# EAGLE schematic xmos_avb_brd_V4 (EAGLE 9.6.2)

## Sheet 1 of 4: XMOS
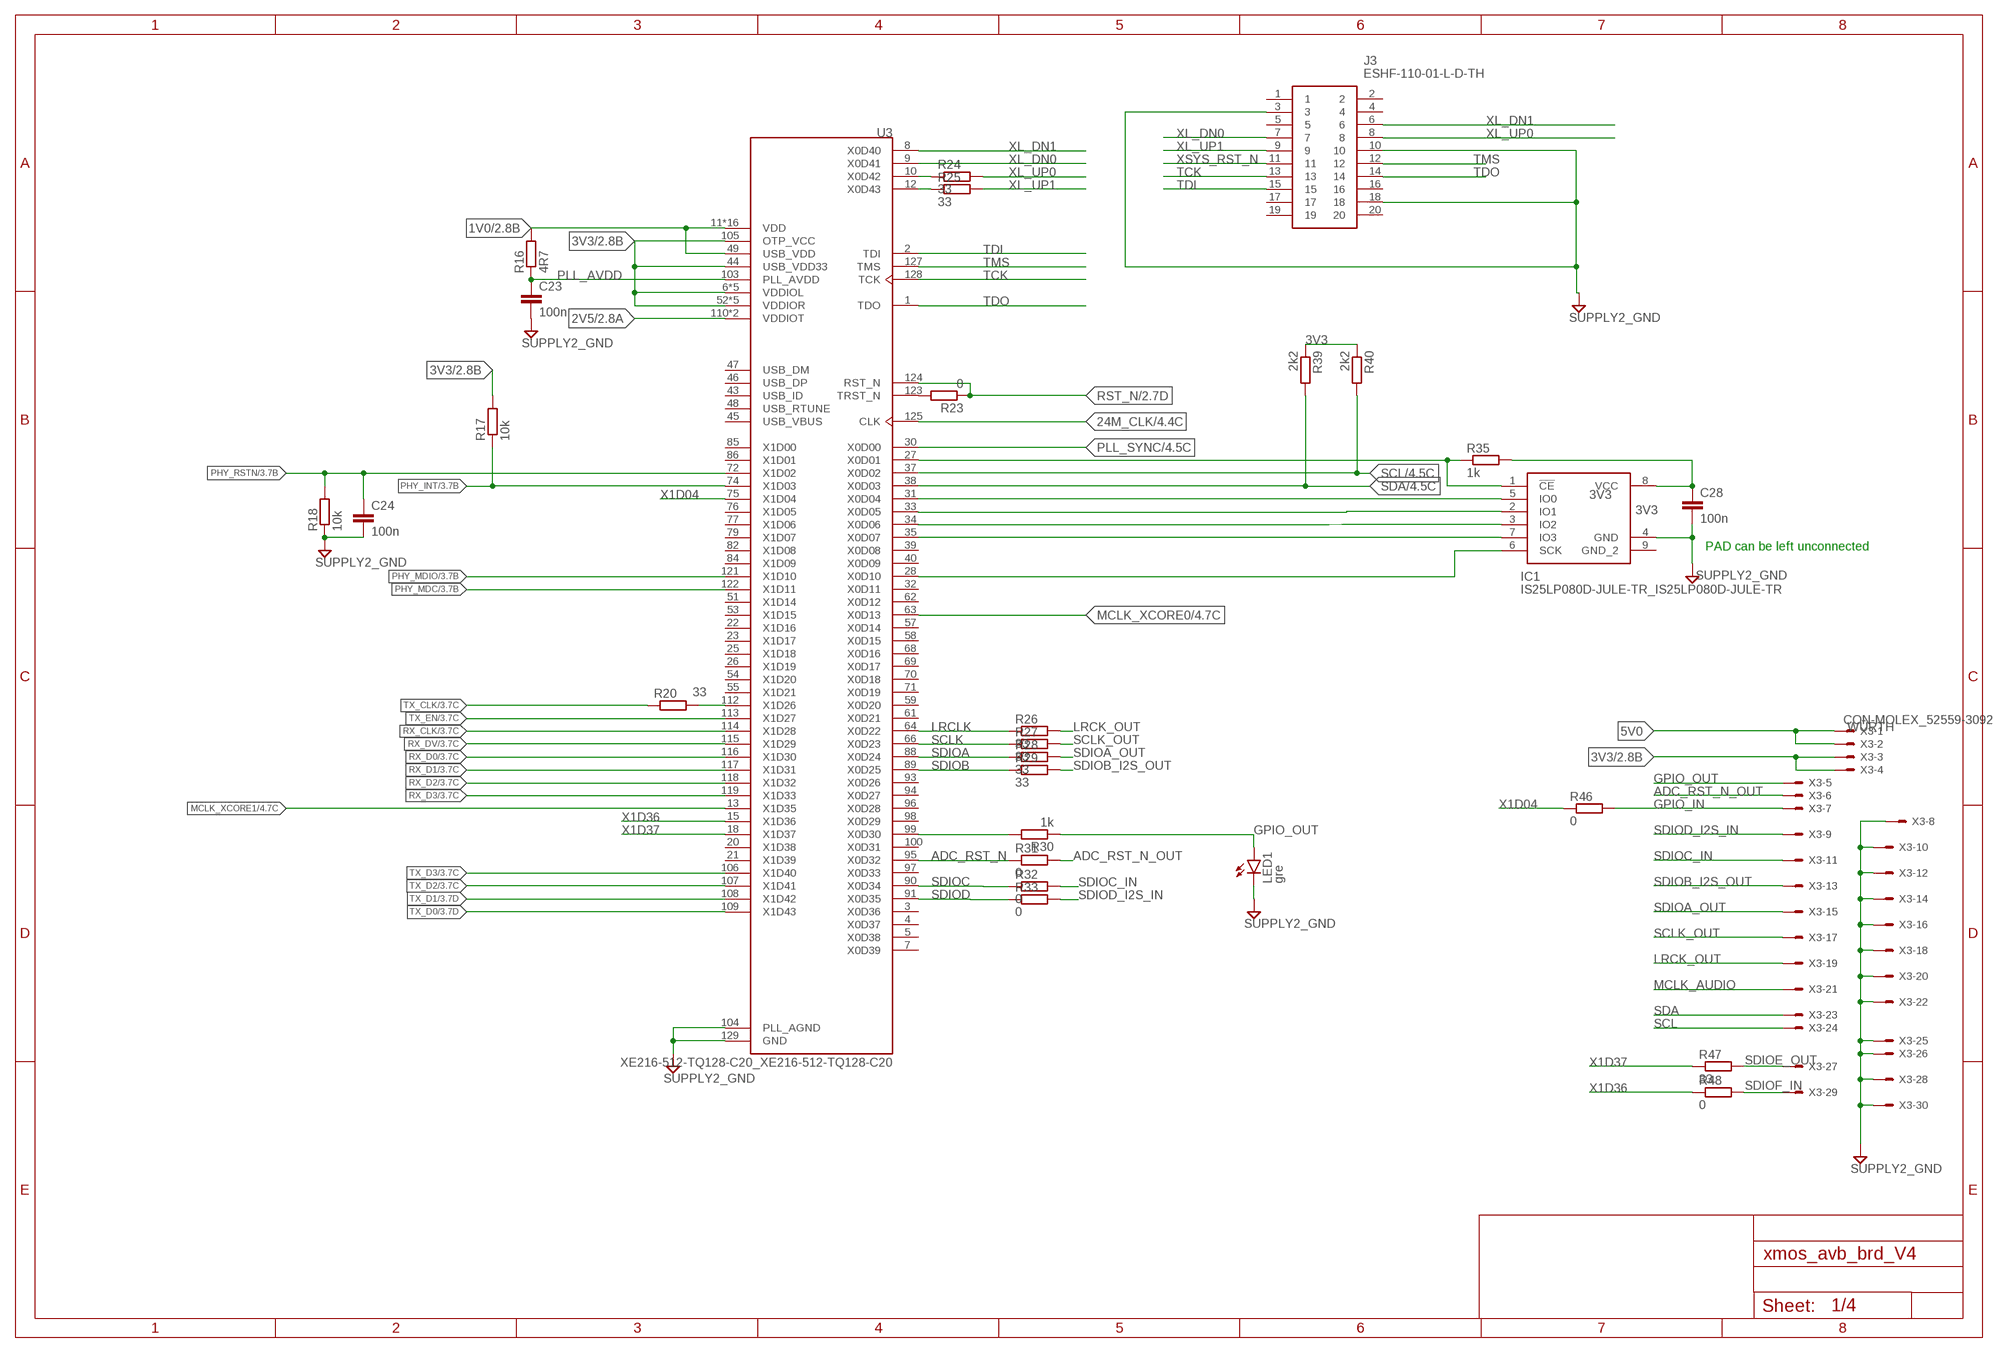
[diagram p0: schematic, sheet 1]

### Parts
C23  100n  RCL_C-EUC0402  [RCL_C0402]
C24  100n  RCL_C-EUC0402  [RCL_C0402]
C28  100n  RCL_C-EUC0402  [RCL_C0402]
IC1  IS25LP080D-JULE-TR_IS25LP080D-JULE-TR  [IS25LP080D-JULE-TR_SON50P300X200X55-9N]
J3  ESHF-110-01-L-D-TH  [SHDR20W41P127_2X10_1905X559X54]
LED1  gre  LED_LEDCHIP-LED0603  [LED_CHIP-LED0603]
R16  4R7  RCL_R-EU_R0402  [RCL_R0402]
R17  10k  RCL_R-EU_R0402  [RCL_R0402]
R18  10k  RCL_R-EU_R0402  [RCL_R0402]
R20  33  RCL_R-EU_R0402  [RCL_R0402]
R23  0  RCL_R-EU_R0402  [RCL_R0402]
R24  33  RCL_R-EU_R0402  [RCL_R0402]
R25  33  RCL_R-EU_R0402  [RCL_R0402]
R26  33  RCL_R-EU_R0402  [RCL_R0402]
R27  33  RCL_R-EU_R0402  [RCL_R0402]
R28  33  RCL_R-EU_R0402  [RCL_R0402]
R29  33  RCL_R-EU_R0402  [RCL_R0402]
R30  1k  RCL_R-EU_R0402  [RCL_R0402]
R31  0  RCL_R-EU_R0402  [RCL_R0402]
R32  0  RCL_R-EU_R0402  [RCL_R0402]
R33  0  RCL_R-EU_R0402  [RCL_R0402]
R35  1k  RCL_R-EU_R0402  [RCL_R0402]
R39  2k2  RCL_R-EU_R0402  [RCL_R0402]
R40  2k2  RCL_R-EU_R0402  [RCL_R0402]
R46  0  RCL_R-EU_R0402  [RCL_R0402]
R47  33  RCL_R-EU_R0402  [RCL_R0402]
R48  0  RCL_R-EU_R0402  [RCL_R0402]
U3  XE216-512-TQ128-C20_XE216-512-TQ128-C20  [XE216-512-TQ128-C20_QFP40P1600X1600X120-129N]
X3  CON-MOLEX_52559-3092  [CON-MOLEX_52559-3092]

### Nets
1V0 [PWR]: R16.2 U3.11(VDD) U3.16(VDD) U3.17(VDD) U3.24(VDD) U3.36(VDD) U3.41(VDD) U3.49(USB_VDD) U3.56(VDD) U3.60(VDD) U3.73(VDD) U3.80(VDD) U3.81(VDD) U3.87(VDD) U3.101(VDD) U3.102(VDD) U3.120(VDD) U3.126(VDD) ; also sheet 2
2V5 [PWR]: U3.110(VDDIOT) U3.111(VDDIOT) ; also sheet 2
3V3 [PWR]: C28.1 IC1.8(VCC) R17.2 R35.2 R39.1 R40.1 U3.6(VDDIOL) U3.14(VDDIOL) U3.19(VDDIOL) U3.29(VDDIOL) U3.42(VDDIOL) U3.44(USB_VDD33) U3.52(VDDIOR) U3.67(VDDIOR) U3.78(VDDIOR) U3.83(VDDIOR) U3.92(VDDIOR) U3.105(OTP_VCC) X3.3 X3.4 ; also sheet 2,3,4
5V0 [PWR]: X3.1 X3.2 ; also sheet 2
24M_CLK [diff pairs]: U3.125(CLK) ; also sheet 4
ADC_RST_N [diff pairs]: R31.1 U3.95(X0D32)
ADC_RST_N_OUT: R31.2 X3.6
GND [GND]: C23.2 C24.2 C28.2 IC1.4(GND) J3.3 J3.10 J3.18 LED1.C R18.1 U3.104(PLL_AGND) U3.129(GND) X3.8 X3.10 X3.12 X3.14 X3.16 X3.18 X3.20 X3.22 X3.25 X3.26 X3.28 X3.30 ; supply symbol labelled SUPPLY2_GND ; also sheet 2,3,4
GPIO_IN: R46.2 X3.7
GPIO_OUT: LED1.A R30.1 X3.5
LRCK_OUT: R26.2 X3.19
LRCLK: R26.1 U3.64(X0D22)
MCLK_AUDIO [diff pairs]: X3.21 ; also sheet 4
MCLK_XCORE0 [diff pairs]: U3.63(X0D13) ; also sheet 4
MCLK_XCORE1 [diff pairs]: U3.13(X1D35) ; also sheet 4
N$5 [diff pairs]: R30.2 U3.99(X0D30)
N$24: IC1.6(SCK) U3.28(X0D10)
N$26: IC1.5(IO0) U3.31(X0D04)
N$28: IC1.2(IO1) U3.33(X0D05)
N$30: IC1.3(IO2) U3.34(X0D06)
N$35: R20.2 U3.112(X1D26)
N$42: IC1.7(IO3) U3.35(X0D07)
N$43: R24.1 U3.10(X0D42)
N$44: R25.1 U3.12(X0D43)
N$77: R23.2 U3.123(TRST_N)
PHY_INT: R17.1 U3.74(X1D03) ; also sheet 3
PHY_MDC: U3.122(X1D11) ; also sheet 3
PHY_MDIO: U3.121(X1D10) ; also sheet 3
PHY_RSTN: C24.1 R18.2 U3.72(X1D02) ; also sheet 3
PLL_AVDD [diff pairs]: C23.1 R16.1 U3.103(PLL_AVDD)
PLL_SYNC: U3.30(X0D00) ; also sheet 4
RST_N: R23.1 U3.124(RST_N) ; also sheet 2
RX_CLK: U3.114(X1D28) ; also sheet 3
RX_D0: U3.116(X1D30) ; also sheet 3
RX_D1: U3.117(X1D31) ; also sheet 3
RX_D2: U3.118(X1D32) ; also sheet 3
RX_D3: U3.119(X1D33) ; also sheet 3
RX_DV: U3.115(X1D29) ; also sheet 3
SCL: R40.2 U3.37(X0D02) X3.24 ; also sheet 4
SCLK [diff pairs]: R27.1 U3.66(X0D23)
SCLK_OUT: R27.2 X3.17
SDA: R39.2 U3.38(X0D03) X3.23 ; also sheet 4
SDIOA [diff pairs]: R28.1 U3.88(X0D24)
SDIOA_OUT: R28.2 X3.15
SDIOB [diff pairs]: R29.1 U3.89(X0D25)
SDIOB_I2S_OUT: R29.2 X3.13
SDIOC [diff pairs]: R32.1 U3.90(X0D34)
SDIOC_IN [diff pairs]: R32.2 X3.11
SDIOD [diff pairs]: R33.1 U3.91(X0D35)
SDIOD_I2S_IN [diff pairs]: R33.2 X3.9
SDIOE_OUT: R47.2 X3.27
SDIOF_IN [diff pairs]: R48.2 X3.29
SPI_CS [diff pairs]: IC1.1(!CE) R35.1 U3.27(X0D01)
TCK: J3.13 U3.128(TCK)
TDI: J3.15 U3.2(TDI)
TDO: J3.14 U3.1(TDO)
TMS: J3.12 U3.127(TMS)
TX_CLK: R20.1 ; also sheet 3
TX_D0: U3.109(X1D43) ; also sheet 3
TX_D1: U3.108(X1D42) ; also sheet 3
TX_D2: U3.107(X1D41) ; also sheet 3
TX_D3: U3.106(X1D40) ; also sheet 3
TX_EN: U3.113(X1D27) ; also sheet 3
X1D04: R46.1 U3.75(X1D04)
X1D36: R48.1 U3.15(X1D36)
X1D37: R47.1 U3.18(X1D37)
XL_DN0 [diff pairs]: J3.7 U3.9(X0D41)
XL_DN1 [diff pairs]: J3.6 U3.8(X0D40)
XL_UP0: J3.8 R24.2
XL_UP1: J3.9 R25.2
XSYS_RST_N: J3.11 ; also sheet 2
Unconnected: IC1.9(GND_2) J3.1 J3.2 J3.4 J3.5 J3.16 J3.17 J3.19 J3.20 U3.3(X0D36) U3.4(X0D37) U3.5(X0D38) U3.7(X0D39) U3.20(X1D38) U3.21(X1D39) U3.22(X1D16) U3.23(X1D17) U3.25(X1D18) U3.26(X1D19) U3.32(X0D11) U3.39(X0D08) U3.40(X0D09) U3.43(USB_ID) U3.45(USB_VBUS) U3.46(USB_DP) U3.47(USB_DM) U3.48(USB_RTUNE) U3.51(X1D14) U3.53(X1D15) U3.54(X1D20) U3.55(X1D21) U3.57(X0D14) U3.58(X0D15) U3.59(X0D20) U3.61(X0D21) U3.62(X0D12) U3.68(X0D16) U3.69(X0D17) U3.70(X0D18) U3.71(X0D19) U3.76(X1D05) U3.77(X1D06) U3.79(X1D07) U3.82(X1D08) U3.84(X1D09) U3.85(X1D00) U3.86(X1D01) U3.93(X0D26) U3.94(X0D27) U3.96(X0D28) U3.97(X0D33) U3.98(X0D29) U3.100(X0D31)

### Notes on the sheet
- PAD can be left unconnected

## Sheet 2 of 4: Power supplies & Reset
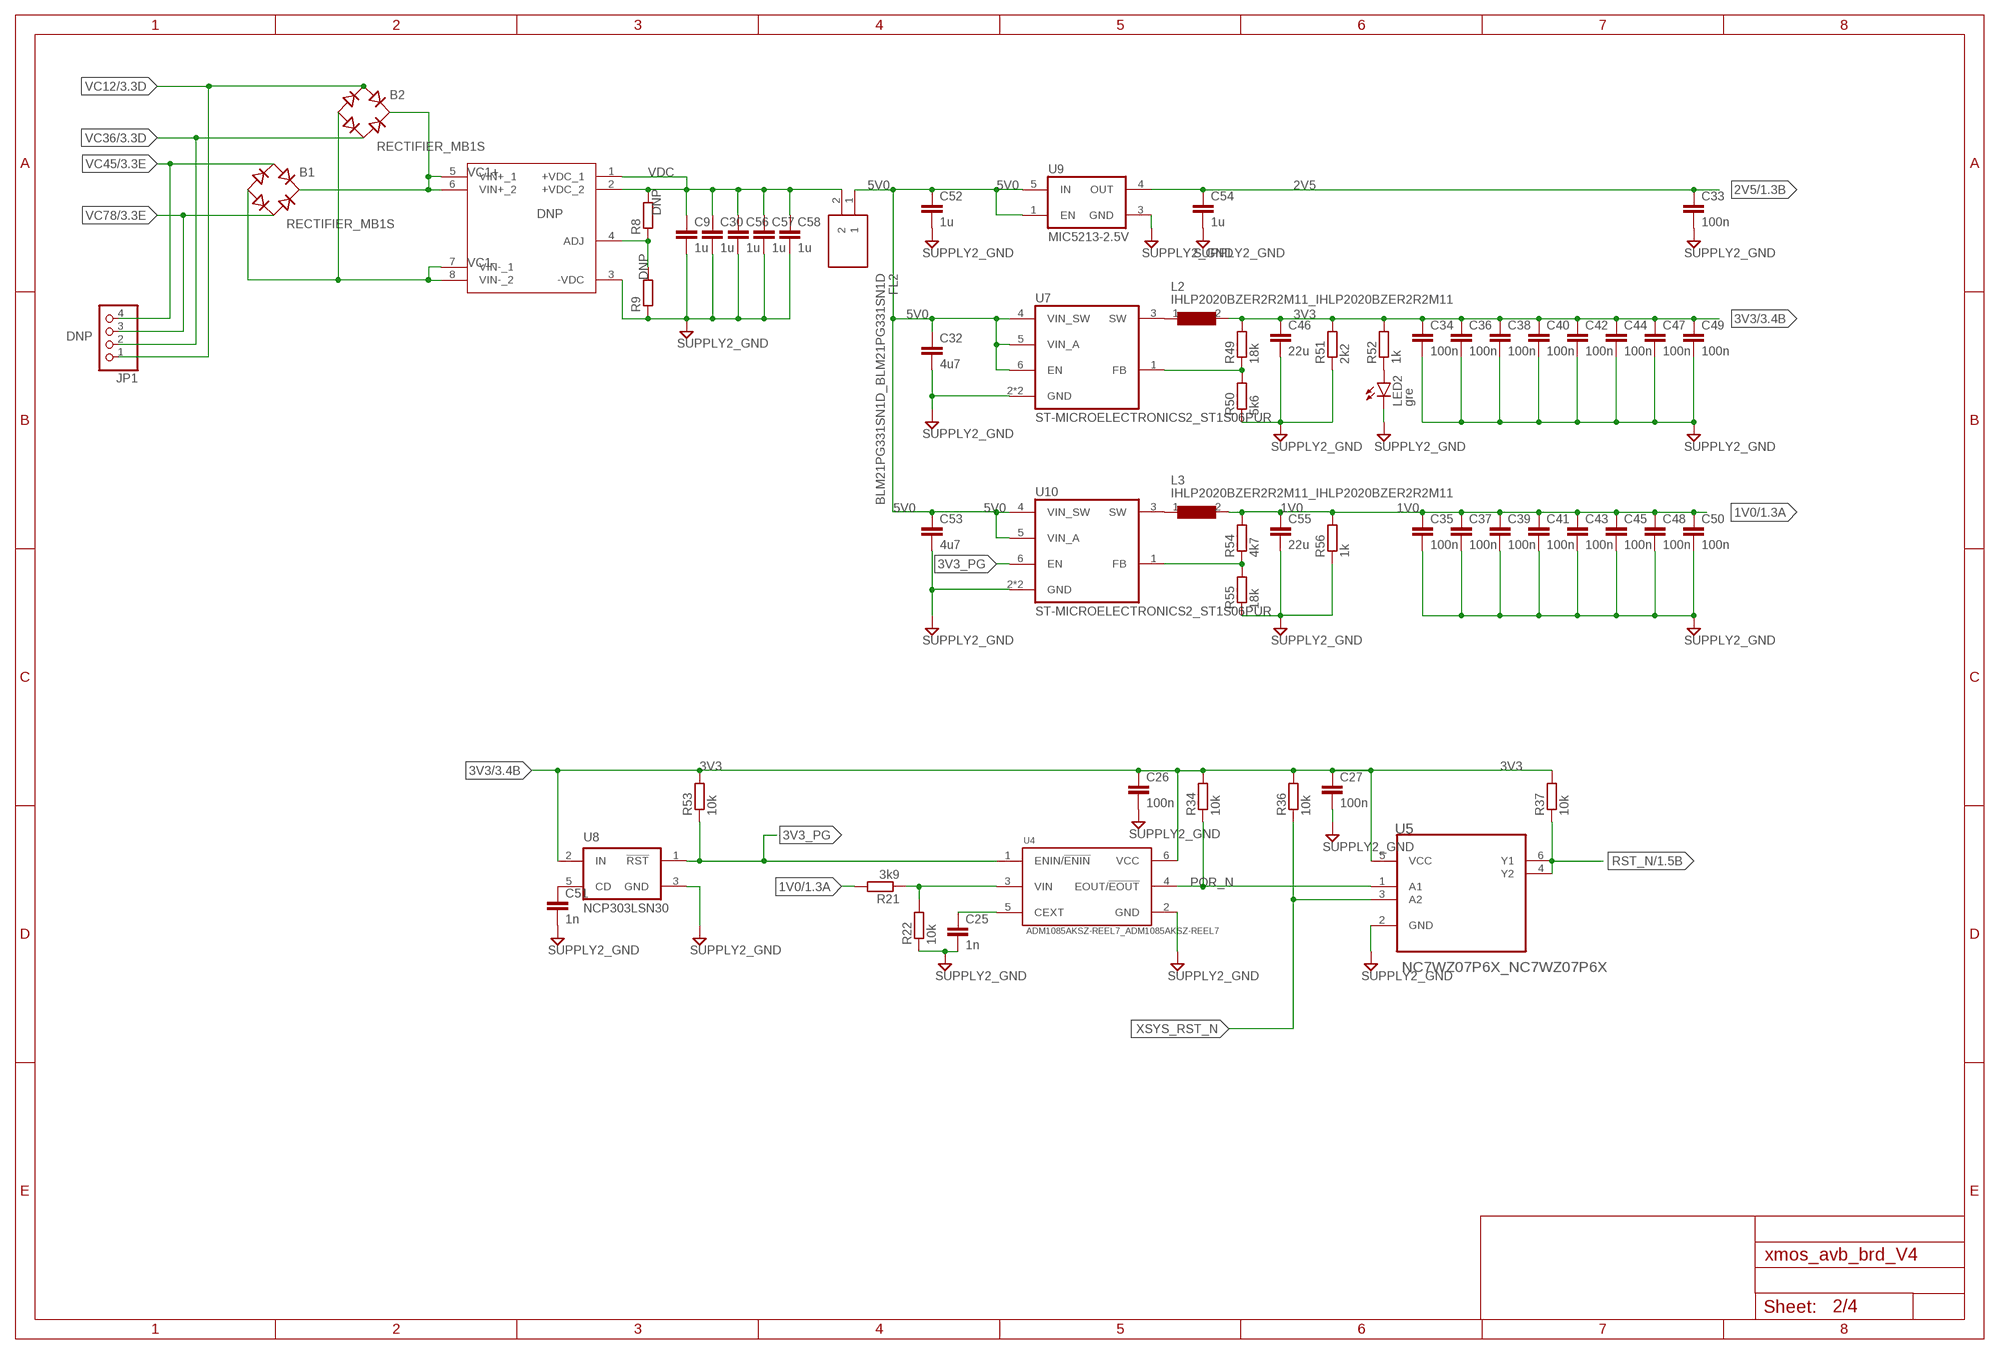
[diagram p1: schematic, sheet 2]

### Parts
B1  RECTIFIER_MB1S  [RECTIFIER_SOIC-4]
B2  RECTIFIER_MB1S  [RECTIFIER_SOIC-4]
C9  1u  RCL_C-EUC1206  [RCL_C1206]
C25  1n  RCL_C-EUC0402  [RCL_C0402]
C26  100n  RCL_C-EUC0402  [RCL_C0402]
C27  100n  RCL_C-EUC0402  [RCL_C0402]
C30  1u  RCL_C-EUC1206  [RCL_C1206]
C32  4u7  RCL_C-EUC1206  [RCL_C1206]
C33  100n  RCL_C-EUC0402  [RCL_C0402]
C34  100n  RCL_C-EUC0402  [RCL_C0402]
C35  100n  RCL_C-EUC0402  [RCL_C0402]
C36  100n  RCL_C-EUC0402  [RCL_C0402]
C37  100n  RCL_C-EUC0402  [RCL_C0402]
C38  100n  RCL_C-EUC0402  [RCL_C0402]
C39  100n  RCL_C-EUC0402  [RCL_C0402]
C40  100n  RCL_C-EUC0402  [RCL_C0402]
C41  100n  RCL_C-EUC0402  [RCL_C0402]
C42  100n  RCL_C-EUC0402  [RCL_C0402]
C43  100n  RCL_C-EUC0402  [RCL_C0402]
C44  100n  RCL_C-EUC0402  [RCL_C0402]
C45  100n  RCL_C-EUC0402  [RCL_C0402]
C46  22u  RCL_C-EUC1206  [RCL_C1206]
C47  100n  RCL_C-EUC0402  [RCL_C0402]
C48  100n  RCL_C-EUC0402  [RCL_C0402]
C49  100n  RCL_C-EUC0402  [RCL_C0402]
C50  100n  RCL_C-EUC0402  [RCL_C0402]
C51  1n  RCL_C-EUC0402  [RCL_C0402]
C52  1u  RCL_C-EUC1206  [RCL_C1206]
C53  4u7  RCL_C-EUC1206  [RCL_C1206]
C54  1u  RCL_C-EUC1206  [RCL_C1206]
C55  22u  RCL_C-EUC1206  [RCL_C1206]
C56  1u  RCL_C-EUC1206  [RCL_C1206]
C57  1u  RCL_C-EUC1206  [RCL_C1206]
C58  1u  RCL_C-EUC1206  [RCL_C1206]
FL2  BLM21PG331SN1D_BLM21PG331SN1D  [BLM21PG331SN1D_BEADC2012X105N]
JP1  PINHEAD_PINHD-1X4  [PINHEAD_1X04]
L2  IHLP2020BZER2R2M11_IHLP2020BZER2R2M11  [IHLP2020BZER2R2M11_INDPM5552X200N]
L3  IHLP2020BZER2R2M11_IHLP2020BZER2R2M11  [IHLP2020BZER2R2M11_INDPM5552X200N]
LED2  gre  LED_LEDCHIP-LED0603  [LED_CHIP-LED0603]
R8  RCL_R-EU_R0402  [RCL_R0402]
R9  RCL_R-EU_R0402  [RCL_R0402]
R21  3k9  RCL_R-EU_R0402  [RCL_R0402]
R22  10k  RCL_R-EU_R0402  [RCL_R0402]
R34  10k  RCL_R-EU_R0402  [RCL_R0402]
R36  10k  RCL_R-EU_R0402  [RCL_R0402]
R37  10k  RCL_R-EU_R0402  [RCL_R0402]
R49  18k  RCL_R-EU_R0402  [RCL_R0402]
R50  5k6  RCL_R-EU_R0402  [RCL_R0402]
R51  2k2  RCL_R-EU_R0402  [RCL_R0402]
R52  1k  RCL_R-EU_R0402  [RCL_R0402]
R53  10k  RCL_R-EU_R0402  [RCL_R0402]
R54  4k7  RCL_R-EU_R0402  [RCL_R0402]
R55  18k  RCL_R-EU_R0402  [RCL_R0402]
R56  1k  RCL_R-EU_R0402  [RCL_R0402]
U1  AG9900_AG9905LP  [AG9900_AG9900LP]
U4  ADM1085AKSZ-REEL7_ADM1085AKSZ-REEL7  [ADM1085AKSZ-REEL7_SOP65P210X95-6N]
U5  NC7WZ07P6X_NC7WZ07P6X  [NC7WZ07P6X_SOT65P210X110-6N]
U7  ST-MICROELECTRONICS2_ST1S06PUR  [ST-MICROELECTRONICS2_DFN6]
U8  NCP303LSN30  ON-SEMI_NCP303  [ON-SEMI_SOT23-5]
U9  MIC5213-2.5V  MICREL2_MIC5213  [MICREL2_SC70-5]
U10  ST-MICROELECTRONICS2_ST1S06PUR  [ST-MICROELECTRONICS2_DFN6]

### Nets
1V0 [PWR]: C35.1 C37.1 C39.1 C41.1 C43.1 C45.1 C48.1 C50.1 C55.1 L3.2 R21.2 R54.2 R56.2 ; also sheet 1
2V5 [PWR]: C33.1 C54.1 U9.4(OUT) ; also sheet 1
3V3 [PWR]: C26.1 C27.1 C34.1 C36.1 C38.1 C40.1 C42.1 C44.1 C46.1 C47.1 C49.1 L2.2 R34.2 R36.2 R37.2 R49.2 R51.2 R52.2 R53.2 U4.6(VCC) U5.5(VCC) U8.2(IN) ; also sheet 1,3,4
3V3_PG: R53.1 U4.1(ENIN/!ENIN) U8.1(!RST!) U10.6(EN)
5V0 [PWR]: C32.1 C52.1 C53.1 FL2.1 U7.4(VIN_SW) U7.5(VIN_A) U7.6(EN) U9.1(EN) U9.5(IN) U10.4(VIN_SW) U10.5(VIN_A) ; also sheet 1
GND [GND]: C9.2 C25.2 C26.2 C27.2 C30.2 C32.2 C33.2 C34.2 C35.2 C36.2 C37.2 C38.2 C39.2 C40.2 C41.2 C42.2 C43.2 C44.2 C45.2 C46.2 C47.2 C48.2 C49.2 C50.2 C51.2 C52.2 C53.2 C54.2 C55.2 C56.2 C57.2 C58.2 LED2.C R9.1 R22.1 R50.1 R51.1 R55.1 R56.1 U1.3(-VDC) U4.2(GND) U5.2(GND) U7.2(GND) U7.7(GND) U8.3(GND) U9.3(GND) U10.2(GND) U10.7(GND) ; supply symbol labelled SUPPLY2_GND ; also sheet 1,3,4
N$2: R21.1 R22.2 U4.3(VIN)
N$7: R8.1 R9.2 U1.4(ADJ)
N$23: L2.1 U7.3(SW)
N$29: L3.1 U10.3(SW)
N$79: C25.1 U4.5(CEXT)
N$82: R54.1 R55.2 U10.1(FB)
N$85: C51.1 U8.5(CD)
N$88 [PWR]: R49.1 R50.2 U7.1(FB)
N$89: LED2.A R52.1
POR_N: R34.1 U4.4(EOUT/!EOUT) U5.1(A1)
RST_N: R37.1 U5.4(Y2) U5.6(Y1) ; also sheet 1
VC1+: B1.+ B2.+ U1.5(VIN+_1) U1.6(VIN+_2)
VC1-: B1.- B2.- U1.7(VIN-_1) U1.8(VIN-_2)
VC12: B2.~1(AC1) JP1.1 ; also sheet 3
VC36: B2.~2(AC2) JP1.2 ; also sheet 3
VC45: B1.~1(AC1) JP1.4 ; also sheet 3
VC78: B1.~2(AC2) JP1.3 ; also sheet 3
VDC [PWR]: C9.1 C30.1 C56.1 C57.1 C58.1 FL2.2 R8.2 U1.1(+VDC_1) U1.2(+VDC_2)
XSYS_RST_N: R36.1 U5.3(A2) ; also sheet 1

## Sheet 3 of 4: Ethernet
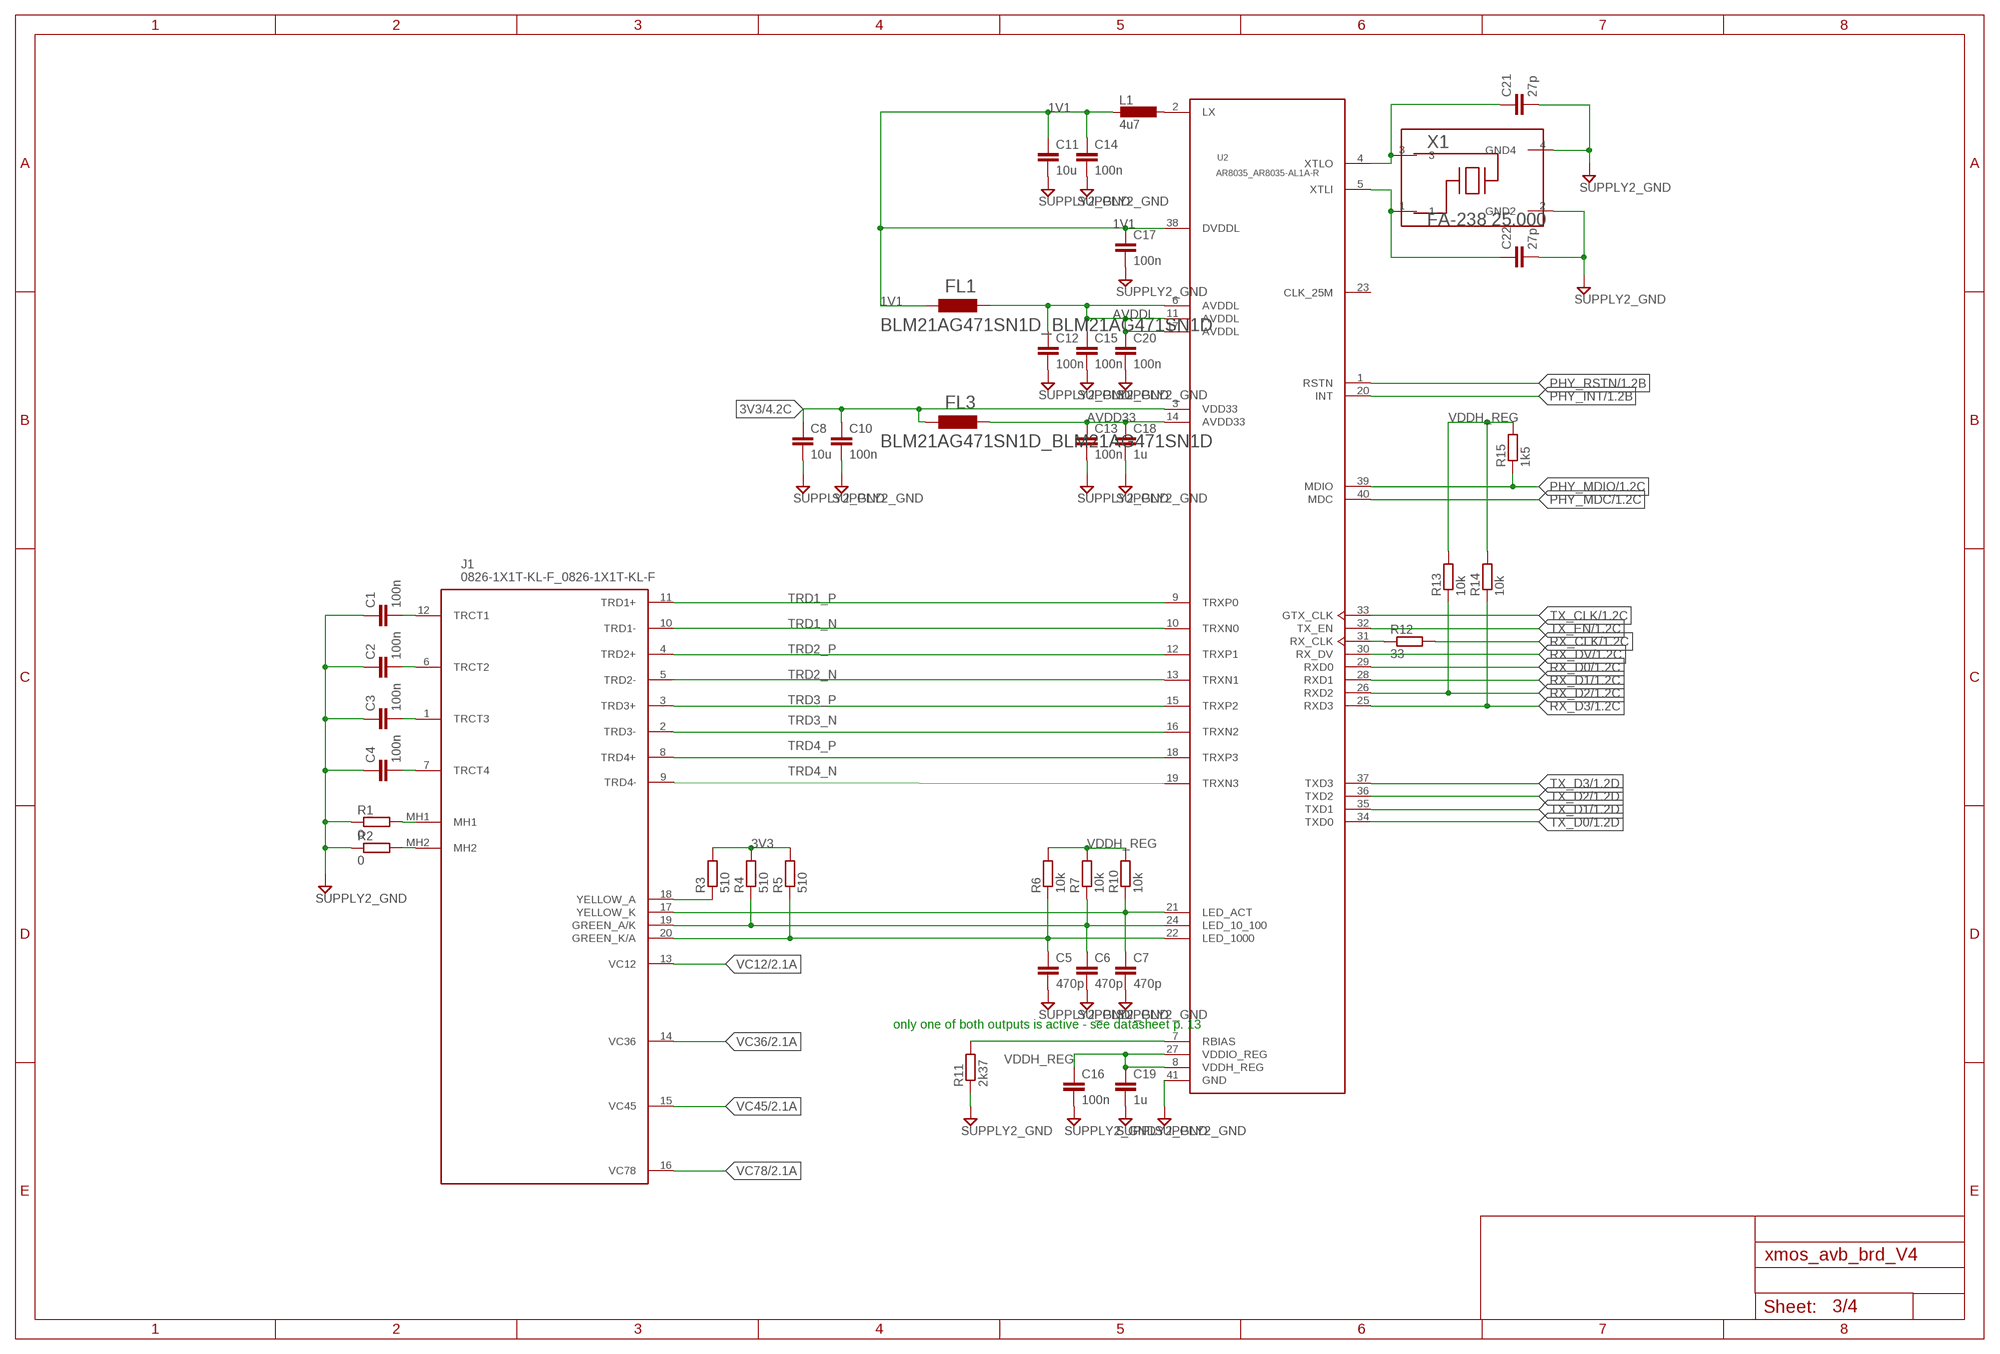
[diagram p2: schematic, sheet 3]

### Parts
C1  100n  RCL_C-EUC0402  [RCL_C0402]
C2  100n  RCL_C-EUC0402  [RCL_C0402]
C3  100n  RCL_C-EUC0402  [RCL_C0402]
C4  100n  RCL_C-EUC0402  [RCL_C0402]
C5  470p  RCL_C-EUC0402  [RCL_C0402]
C6  470p  RCL_C-EUC0402  [RCL_C0402]
C7  470p  RCL_C-EUC0402  [RCL_C0402]
C8  10u  RCL_C-EUC1206  [RCL_C1206]
C10  100n  RCL_C-EUC0402  [RCL_C0402]
C11  10u  RCL_C-EUC1206  [RCL_C1206]
C12  100n  RCL_C-EUC0402  [RCL_C0402]
C13  100n  RCL_C-EUC0402  [RCL_C0402]
C14  100n  RCL_C-EUC0402  [RCL_C0402]
C15  100n  RCL_C-EUC0402  [RCL_C0402]
C16  100n  RCL_C-EUC0402  [RCL_C0402]
C17  100n  RCL_C-EUC0402  [RCL_C0402]
C18  1u  RCL_C-EUC1206  [RCL_C1206]
C19  1u  RCL_C-EUC1206  [RCL_C1206]
C20  100n  RCL_C-EUC0402  [RCL_C0402]
C21  27p  RCL_C-EUC0402  [RCL_C0402]
C22  27p  RCL_C-EUC0402  [RCL_C0402]
FL1  BLM21AG471SN1D_BLM21AG471SN1D  [BLM21AG471SN1D_BEADC2012X105N]
FL3  BLM21AG471SN1D_BLM21AG471SN1D  [BLM21AG471SN1D_BEADC2012X105N]
J1  0826-1X1T-KL-F_0826-1X1T-KL-F  [0826-1X1T-KL-F_08261X1TKLF]
L1  4u7  RCL_L-EUL2012C  [RCL_L2012C]
R1  0  RCL_R-EU_R0402  [RCL_R0402]
R2  0  RCL_R-EU_R0402  [RCL_R0402]
R3  510  RCL_R-EU_R0402  [RCL_R0402]
R4  510  RCL_R-EU_R0402  [RCL_R0402]
R5  510  RCL_R-EU_R0402  [RCL_R0402]
R6  10k  RCL_R-EU_R0402  [RCL_R0402]
R7  10k  RCL_R-EU_R0402  [RCL_R0402]
R10  10k  RCL_R-EU_R0402  [RCL_R0402]
R11  2k37  RCL_R-EU_R0402  [RCL_R0402]
R12  33  RCL_R-EU_R0402  [RCL_R0402]
R13  10k  RCL_R-EU_R0402  [RCL_R0402]
R14  10k  RCL_R-EU_R0402  [RCL_R0402]
R15  1k5  RCL_R-EU_R0402  [RCL_R0402]
U2  AR8035_AR8035-AL1A-R  [AR8035_QFN40P500X500X75-41N]
X1  FA-238 25.000  FA-238_FA-238  [FA-238_OSCCC320X250X70-4N]

### Nets
1V1 [diff pairs]: C11.1 C14.1 C17.1 FL1.1 L1.2 U2.38(DVDDL)
3V3 [PWR]: C8.1 C10.1 FL3.1 R3.2 R4.2 R5.2 U2.3(VDD33) ; also sheet 1,2,4
AVDD33 [PWR]: C13.1 C18.1 FL3.2 U2.14(AVDD33)
AVDDL [PWR]: C12.1 C15.1 C20.1 FL1.2 U2.6(AVDDL) U2.11(AVDDL) U2.17(AVDDL)
GND [GND]: C1.1 C2.1 C3.1 C4.1 C5.2 C6.2 C7.2 C8.2 C10.2 C11.2 C12.2 C13.2 C14.2 C15.2 C16.2 C17.2 C18.2 C19.2 C20.2 C21.2 C22.2 R1.1 R2.1 R11.1 U2.41(GND) X1.2(GND2) X1.4(GND4) ; supply symbol labelled SUPPLY2_GND ; also sheet 1,2,4
N$3: L1.1 U2.2(LX)
N$4: J1.MH1 R1.2
N$6: C6.1 J1.19(GREEN_A/K) R4.1 R7.1 U2.24(LED_10_100)
N$8: J1.18(YELLOW_A) R3.1
N$9: C21.1 U2.4(XTLO) X1.3
N$10: C22.1 U2.5(XTLI) X1.1
N$13: R12.1 U2.31(RX_CLK)
N$14: C7.1 J1.17(YELLOW_K) R10.1 U2.21(LED_ACT)
N$15: C1.2 J1.12(TRCT1)
N$18: C2.2 J1.6(TRCT2)
N$20: R11.2 U2.7(RBIAS)
N$54: C5.1 J1.20(GREEN_K/A) R5.1 R6.1 U2.22(LED_1000)
N$56: C3.2 J1.1(TRCT3)
N$58: C4.2 J1.7(TRCT4)
N$64: J1.MH2 R2.2
PHY_INT: U2.20(INT) ; also sheet 1
PHY_MDC: U2.40(MDC) ; also sheet 1
PHY_MDIO: R15.1 U2.39(MDIO) ; also sheet 1
PHY_RSTN: U2.1(RSTN) ; also sheet 1
RX_CLK: R12.2 ; also sheet 1
RX_D0: U2.29(RXD0) ; also sheet 1
RX_D1: U2.28(RXD1) ; also sheet 1
RX_D2: R13.1 U2.26(RXD2) ; also sheet 1
RX_D3: R14.1 U2.25(RXD3) ; also sheet 1
RX_DV: U2.30(RX_DV) ; also sheet 1
TRD1_N [diff pairs]: J1.10(TRD1-) U2.10(TRXN0)
TRD1_P [diff pairs]: J1.11(TRD1+) U2.9(TRXP0)
TRD2_N [diff pairs]: J1.5(TRD2-) U2.13(TRXN1)
TRD2_P [diff pairs]: J1.4(TRD2+) U2.12(TRXP1)
TRD3_N [diff pairs]: J1.2(TRD3-) U2.16(TRXN2)
TRD3_P [diff pairs]: J1.3(TRD3+) U2.15(TRXP2)
TRD4_N [diff pairs]: J1.9(TRD4-) U2.19(TRXN3)
TRD4_P [diff pairs]: J1.8(TRD4+) U2.18(TRXP3)
TX_CLK: U2.33(GTX_CLK) ; also sheet 1
TX_D0: U2.34(TXD0) ; also sheet 1
TX_D1: U2.35(TXD1) ; also sheet 1
TX_D2: U2.36(TXD2) ; also sheet 1
TX_D3: U2.37(TXD3) ; also sheet 1
TX_EN: U2.32(TX_EN) ; also sheet 1
VC12: J1.13(VC12) ; also sheet 2
VC36: J1.14(VC36) ; also sheet 2
VC45: J1.15(VC45) ; also sheet 2
VC78: J1.16(VC78) ; also sheet 2
VDDH_REG: C16.1 C19.1 R6.2 R7.2 R10.2 R13.2 R14.2 R15.2 U2.8(VDDH_REG) U2.27(VDDIO_REG)
Unconnected: U2.23(CLK_25M)

### Notes on the sheet
- only one of both outputs is active - see datasheet p. 13

## Sheet 4 of 4: Audio Clocking
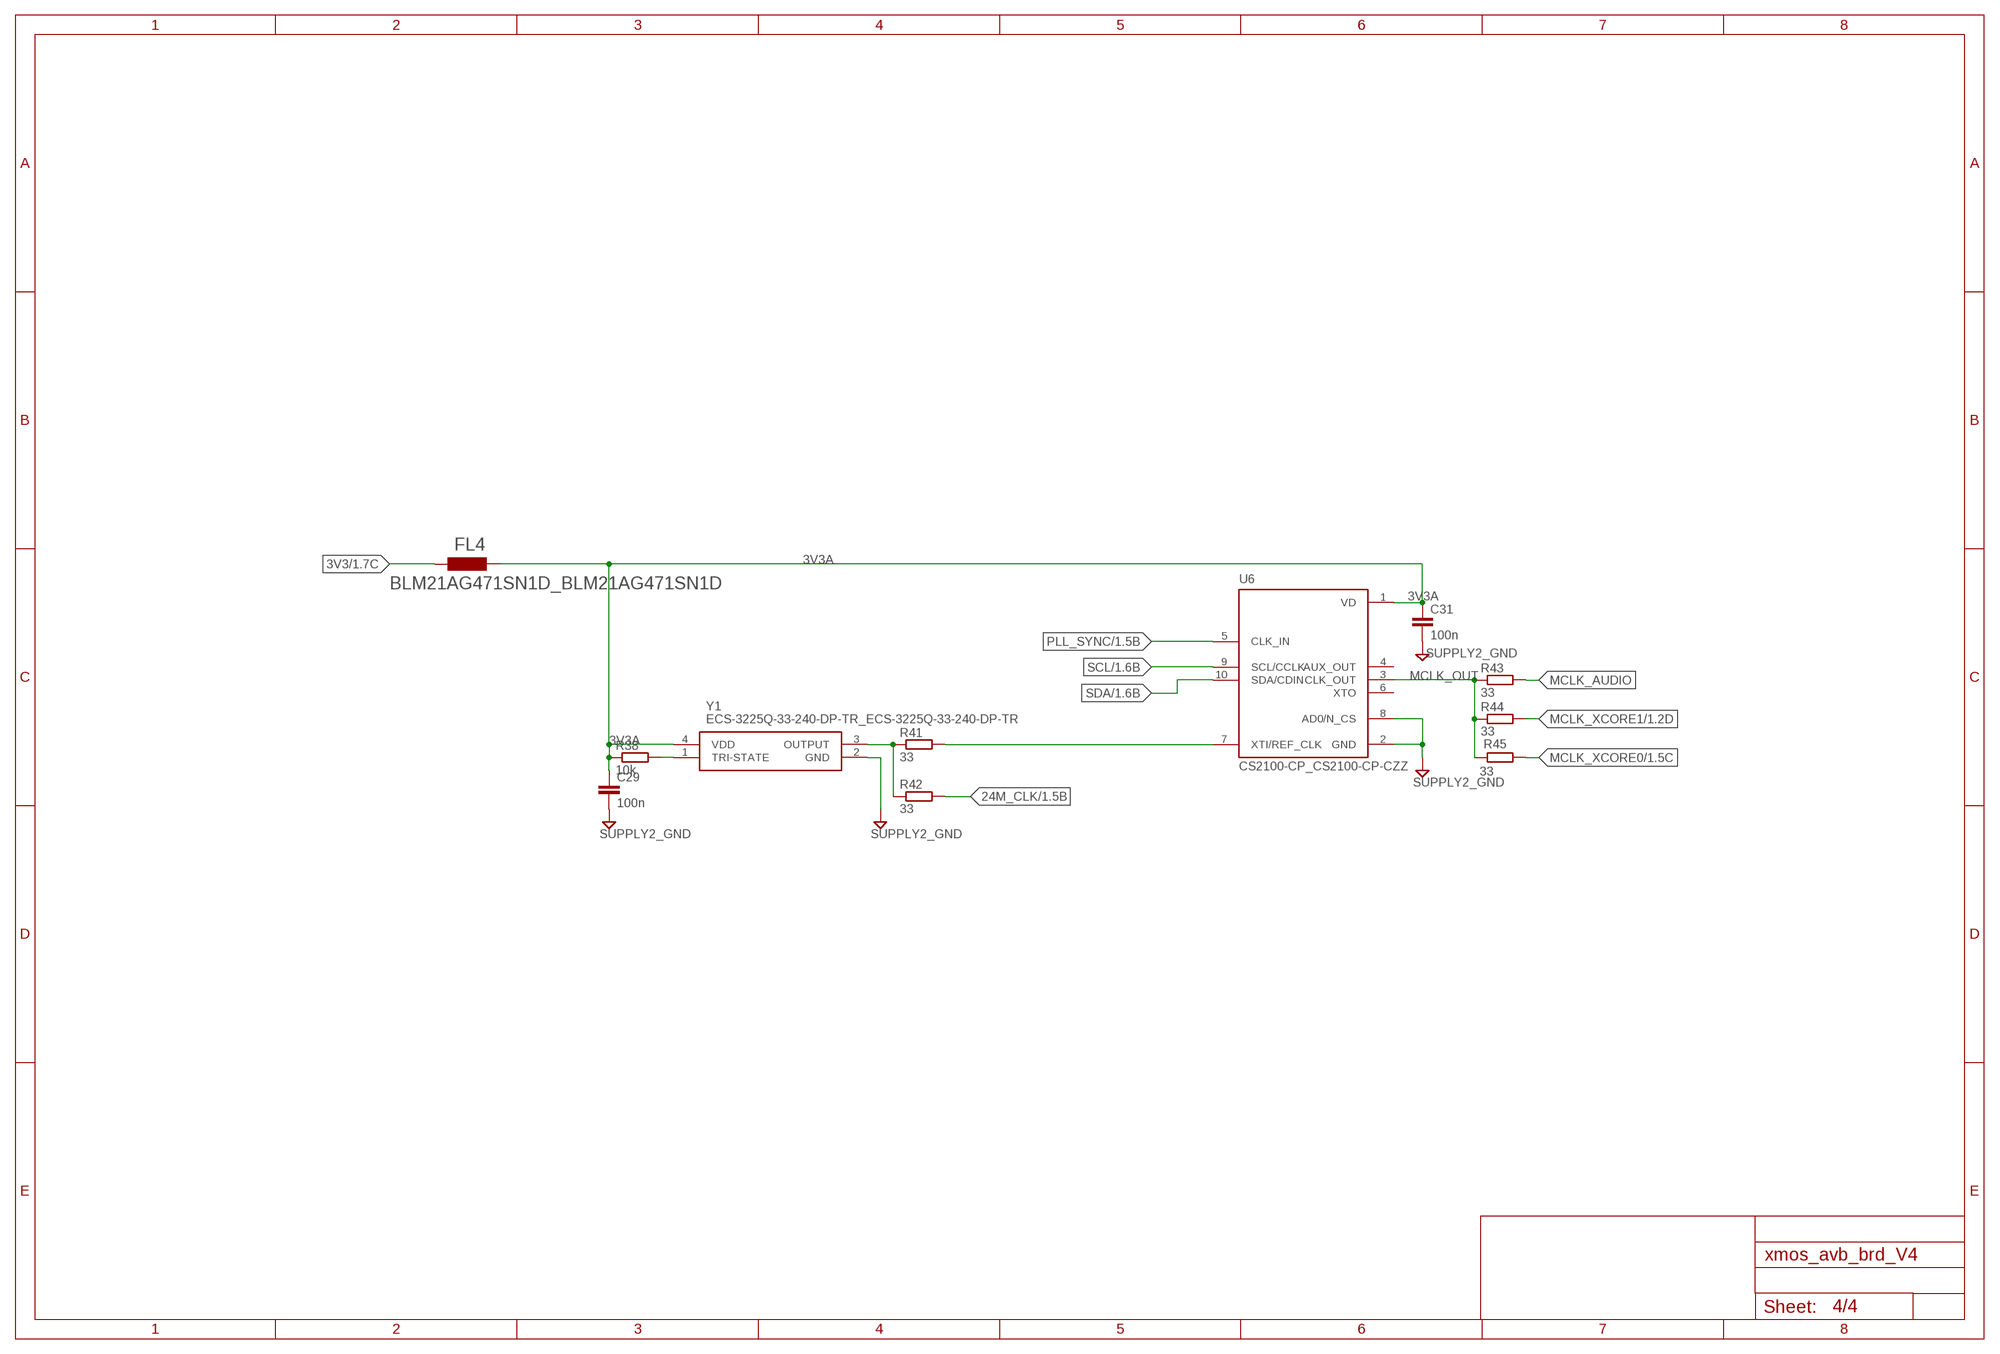
[diagram p3: schematic, sheet 4]

### Parts
C29  100n  RCL_C-EUC0402  [RCL_C0402]
C31  100n  RCL_C-EUC0402  [RCL_C0402]
FL4  BLM21AG471SN1D_BLM21AG471SN1D  [BLM21AG471SN1D_BEADC2012X105N]
R38  10k  RCL_R-EU_R0402  [RCL_R0402]
R41  33  RCL_R-EU_R0402  [RCL_R0402]
R42  33  RCL_R-EU_R0402  [RCL_R0402]
R43  33  RCL_R-EU_R0402  [RCL_R0402]
R44  33  RCL_R-EU_R0402  [RCL_R0402]
R45  33  RCL_R-EU_R0402  [RCL_R0402]
U6  CS2100-CP_CS2100-CP-CZZ  [CS2100-CP_CIRRUS-LOGIC_MSOP10]
Y1  ECS-3225Q-33-240-DP-TR_ECS-3225Q-33-240-DP-TR  [ECS-3225Q-33-240-DP-TR_ECS3225Q33240DPTR]

### Nets
3V3 [PWR]: FL4.1 ; also sheet 1,2,3
3V3A: C29.1 C31.1 FL4.2 R38.1 U6.1(VD) Y1.4(VDD)
24M_CLK [diff pairs]: R42.2 ; also sheet 1
GND [GND]: C29.2 C31.2 U6.2(GND) U6.8(AD0/N_CS) Y1.2(GND) ; supply symbol labelled SUPPLY2_GND ; also sheet 1,2,3
MCLK_AUDIO [diff pairs]: R43.2 ; also sheet 1
MCLK_OUT [diff pairs]: R43.1 R44.1 R45.2 U6.3(CLK_OUT)
MCLK_XCORE0 [diff pairs]: R45.1 ; also sheet 1
MCLK_XCORE1 [diff pairs]: R44.2 ; also sheet 1
N$16: R41.1 R42.1 Y1.3(OUTPUT)
N$19: R41.2 U6.7(XTI/REF_CLK)
N$25: R38.2 Y1.1(TRI-STATE)
PLL_SYNC: U6.5(CLK_IN) ; also sheet 1
SCL: U6.9(SCL/CCLK) ; also sheet 1
SDA: U6.10(SDA/CDIN) ; also sheet 1
Unconnected: U6.4(AUX_OUT) U6.6(XTO)

## Library data of the parts
B1 B2 = xmos_avb_brd_V4:RECTIFIER_MB*S: Bridge Rectifier Source: http://www.fairchildsemi.com/ds/MB/MB6S.pdf
C1-C58 = xmos_avb_brd_V4:RCL_C-EU: CAPACITOR, European symbol
FL1 FL3 FL4 = xmos_avb_brd_V4:BLM21AG471SN1D_BLM21AG471SN1D: Ferrite SMD [Murata] BLM21AG471SN1D Ferrite SMD; AVAILABILITY: Unavailable; DESCRIPTION: BLM21 Series 0805 470 Ohm 700 mA 190 mOhm DCR Surface Mount Ferrite Bead; MF: Murata Electronics; MP: BLM21AG471SN1D; PACKAGE: 2012 Murata; PRICE: None
FL2 = xmos_avb_brd_V4:BLM21PG331SN1D_BLM21PG331SN1D: BLM21_N1D Series EMI Suppression Filter 330+/-25% at 100MHz 1.5A @85 Source: Datasheet <https://componentsearchengine.com/Datasheets/1/BLM21PG331SN1D.pdf>; DESCRIPTION: BLM21_N1D Series EMI Suppression Filter 330+/-25% at 100MHz 1.5A @85; HEIGHT: 1.05mm; MANUFACTURER_NAME: Murata Electronics; MANUFACTURER_PART_NUMBER: BLM21PG331SN1D; MOUSER_PART_NUMBER: 81-BLM21P331SG; MOUSER_PRICE-STOCK: https://www.mouser.com/Search/Refine.aspx?Keyword=81-BLM21P331SG
IC1 = xmos_avb_brd_V4:IS25LP080D-JULE-TR_IS25LP080D-JULE-TR: NOR Flash 8Mb QSPI, 8-pin USON 2x3mm, RoHS, T&R Source: Datasheet <https://componentsearchengine.com/Datasheets/1/IS25LP080D-JULE-TR.pdf>; DESCRIPTION: NOR Flash 8Mb QSPI, 8-pin USON 2x3mm, RoHS, T&R; HEIGHT: 0.55mm; MANUFACTURER_NAME: Integrated Silicon Solution Inc.; MANUFACTURER_PART_NUMBER: IS25LP080D-JULE-TR
J1 = xmos_avb_brd_V4:0826-1X1T-KL-F_0826-1X1T-KL-F: Conn RJ-45 F 8 POS 1.02mm Solder RA Thru-Hole 20 Terminal 1 Port MagJack Tray Source: Datasheet <https://componentsearchengine.com/Datasheets/2/0826-1X1T-KL-F.pdf>; DESCRIPTION: Conn RJ-45 F 8 POS 1.02mm Solder RA Thru-Hole 20 Terminal 1 Port MagJack Tray; HEIGHT: 13.61mm; MANUFACTURER_NAME: Bel Magnetic Solutions; MANUFACTURER_PART_NUMBER: 0826-1X1T-KL-F; MOUSER_PART_NUMBER: 530-0826-1X1T-KL-F; MOUSER_PRICE-STOCK: https://www.mouser.co.uk/ProductDetail/Bel-Magnetic-Solutions/0826-1X1T-KL-F?qs=wnTfsH77Xs6Vloaw6rcFYA%3D%3D
J3 = ESHF-110-01-L-D-TH:ESHF-110-01-L-D-TH: .050" Shrouded Terminal Strip For FFSD, through hole, dual row, 10 positions per row Source: Datasheet <http://suddendocs.samtec.com/prints/shf-1xx-01-x-d-xx-xx-mkt.pdf>; DESCRIPTION: .050" Shrouded Terminal Strip For FFSD, through hole, dual row, 10 positions per row; HEIGHT: 5.46mm; MANUFACTURER_NAME: SAMTEC; MANUFACTURER_PART_NUMBER: ESHF-110-01-L-D-TH; MOUSER_PART_NUMBER: 200-ESHF11001LDTH; MOUSER_PRICE-STOCK: https://www.mouser.co.uk/ProductDetail/Samtec/ESHF-110-01-L-D-TH?qs=PB6%2FjmICvI0mxf%2Fbo3P5fg%3D%3D
JP1 = xmos_avb_brd_V4:PINHEAD_PINHD-1X4: PIN HEADER; DNP: DNP
L1 = xmos_avb_brd_V4:RCL_L-EU: INDUCTOR, European symbol; SPICEPREFIX: L
L2 L3 = xmos_avb_brd_V4:IHLP2020BZER2R2M11_IHLP2020BZER2R2M11: Vishay IHLP2020BZ-11 Series Shielded Wire-wound SMD Inductor 2.2 uH +/-20% 5.5A Idc Source: Datasheet <https://componentsearchengine.com/Datasheets/1/IHLP2020BZER2R2M11.pdf>; DESCRIPTION: Vishay IHLP2020BZ-11 Series Shielded Wire-wound SMD Inductor 2.2 uH +/-20% 5.5A Idc; HEIGHT: 2mm; MANUFACTURER_NAME: Vishay; MANUFACTURER_PART_NUMBER: IHLP2020BZER2R2M11; MOUSER_PART_NUMBER: 70-IHLP2020BZER2R2M1; MOUSER_PRICE-STOCK: https://www.mouser.com/Search/Refine.aspx?Keyword=70-IHLP2020BZER2R2M1
LED1 LED2 = xmos_avb_brd_V4:LED_LED: LED OSRAM: - CHIPLED LG R971, LG N971, LY N971, LG Q971, LY Q971, LO R971, LY R971 LH N974, LH R974 LS Q976, LO Q976, LY Q976 LO Q996 - Hyper CHIPLED LW Q18S LB Q993, LB Q99A, LB R99A - SideLED LS A670, LO A670, LY A670, LG A670, LP A670 LB A673, LV A673, LT A673, LW A673 LH A674 LY A675 LS A676, LA A676, LO A676, LY A676, LW A676 LS A679, LY A679, LG A679 - Hyper Micro SIDELED® LS Y876, LA Y876, LO Y876, LY Y876 LT Y87S - SmartLED LW L88C, LW L88S LB L89C, LB L89S, LG L890 LS L89K, LO L89K, LY L89K LS L896, LA L896, LO L896, LY L896 - TOPLED LS T670, LO T670, LY T670, LG T670, LP T670 LSG T670, LSP T670, LSY T670, LOP T670, LYG T670 LG T671, LOG T671, LSG T671 LB T673, LV T673, LT T673, LW T673 LH T674 LS T676, LA T676, LO T676, LY T676, LB T676, LH T676, LSB T676, LW T676 LB T67C, LV T67C, LT T67C, LS T67K, LO T67K, LY T67K, LW E67C LS E67B, LA E67B, LO E67B, LY E67B, LB E67C, LV E67C, LT E67C LW T67C LS T679, LY T679, LG T679 LS T770, LO T770, LY T770, LG T770, LP T770 LB T773, LV T773, LT T773, LW T773 LH T774 LS E675, LA E675, LY E675, LS T675 LS T776, LA T776, LO T776, LY T776, LB T776 LHGB T686 LT T68C, LB T68C - Hyper Mini TOPLED® LB M676 - Mini TOPLED Santana® LG M470 LS M47K, LO M47K, LY M47K Source: http://www.osram.convergy.de LUXEON: - LUMILED® LXK2-PW12-R00, LXK2-PW12-S00, LXK2-PW14-U00, LXK2-PW14-V00 LXK2-PM12-R00, LXK2-PM12-S00, LXK2-PM14-U00 LXK2-PE12-Q00, LXK2-PE12-R00, LXK2-PE12-S00, LXK2-PE14-T00, LXK2-PE14-U00 LXK2-PB12-K00, LXK2-PB12-L00, LXK2-PB12-M00, LXK2-PB14-N00, LXK2-PB14-P00, LXK2-PB14-Q00 LXK2-PR12-L00, LXK2-PR12-M00, LXK2-PR14-Q00, LXK2-PR14-R00 LXK2-PD12-Q00, LXK2-PD12-R00, LXK2-PD12-S00 LXK2-PH12-R00, LXK2-PH12-S00 LXK2-PL12-P00, LXK2-PL12-Q00, LXK2-PL12-R00 Source: www.luxeon.com KINGBRIGHT: KA-3528ASYC Source: www.kingbright.com
R1-R7 R10-R18 R20-R56 = xmos_avb_brd_V4:RCL_R-EU_: RESISTOR, European symbol
R8 R9 = xmos_avb_brd_V4:RCL_R-EU_: RESISTOR, European symbol; DNP: DNP
U1 = xmos_avb_brd_V4:AG9900_AG9905LP: PoE Module for powered devices 7W, 5V, THT; DNP: DNP; MF: Silvertel; MP: AG9905LP
U2 = xmos_avb_brd_V4:AR8035_AR8035-AL1A-R: AR8035 Integrated 10/100/1000 Gigabit Ethernet Transceiver; MF: Qualcomm; MP: AR8035-AL1A-R; PACKAGE: QFN-40 Qualcomm; PRICE: None
U3 = xmos_avb_brd_V4:XE216-512-TQ128-C20_XE216-512-TQ128-C20: XE Series 512 kB RAM 2000 MIPS 16-Core 32-bit Microcontroller - TQFP-128; AVAILABILITY: Unavailable; DESCRIPTION: XE Series 512 kB RAM 2000 MIPS 16-Core 32-bit Microcontroller - TQFP-128; MF: XMOS; MP: XE216-512-TQ128-C20; PACKAGE: TQFP-128 XMOS; PRICE: None
U4 = xmos_avb_brd_V4:ADM1085AKSZ-REEL7_ADM1085AKSZ-REEL7: Volt Supervisor Sequencer 0V to 22V 6-Pin SC-70 T/R; AVAILABILITY: Unavailable; DESCRIPTION: Volt Supervisor Sequencer 0V to 22V 6-Pin SC-70 T/R; MF: Analog Devices; MP: ADM1085AKSZ-REEL7; PACKAGE: SC-70-6 Analog Devices; PRICE: None
U5 = xmos_avb_brd_V4:NC7WZ07P6X_NC7WZ07P6X: UHS Dual Buffer; AVAILABILITY: Unavailable; DESCRIPTION: NC7WZ07 Series 5.5 V TinyLogic UHS Dual Buffer _Open Drain Output_ - SC-70-6; MF: ON Semiconductor; MP: NC7WZ07P6X; PACKAGE: SC-70-6 ON Semiconductor; PRICE: None
U6 = xmos_avb_brd_V4:CS2100-CP_CS2100-CP-CZZ
U7 U10 = xmos_avb_brd_V4:ST-MICROELECTRONICS2_ST1S06PUR: BUCK REGULATOR ADJ 1.5A SYNC
U8 = xmos_avb_brd_V4:ON-SEMI_NCP303: Voltage Detector with programmable delay
U9 = xmos_avb_brd_V4:MICREL2_MIC5213: LDO VOLTAGE REGULATOR
X1 = xmos_avb_brd_V4:FA-238_FA-238: Crystal 25.0000mhz 18pf Smd; AVAILABILITY: Unavailable; MANUFACTURER_PART_NUMBER: FA-238 25.0000MB-C3; MF: Epson; MP: FA-238; PACKAGE: SMD-4 Epson; PRICE: None
X3 = xmos_avb_brd_V4:CON-MOLEX_52559-3092: FFC/FPC-to-Board 0.50mm (.020") SMT, Vertical, ZIF Receptacle Source: http://www.molex.com/product/ffc/52559.html; MF: WÜRTH; MF2: WÜRTH; MPN: 687330124422; MPN2: 687330124422
Y1 = xmos_avb_brd_V4:ECS-3225Q-33-240-DP-TR_ECS-3225Q-33-240-DP-TR: Standard Clock Oscillators 24MHz HCMOS AEC-Q200 3.3V Source: Datasheet <https://componentsearchengine.com/Datasheets/1/ECS-3225Q-33-240-DP-TR.pdf>; DESCRIPTION: Standard Clock Oscillators 24MHz HCMOS AEC-Q200 3.3V; HEIGHT: 2mm; MANUFACTURER_NAME: ECS; MANUFACTURER_PART_NUMBER: ECS-3225Q-33-240-DP-TR; MOUSER_PART_NUMBER: 520-3225Q-33-240-DPT; MOUSER_PRICE-STOCK: https://www.mouser.com/Search/Refine.aspx?Keyword=520-3225Q-33-240-DPT

## Net classes
0 default: width 0.2 mm, drill 0.2 mm
1 GND: width 0.2 mm, drill 0.2 mm
2 diff pairs: width 0.15 mm, drill 0.2 mm
3 PWR: width 0.2 mm, drill 0.2 mm